# Altium schematic sheet USB-TTL UART.SchDoc
size A4; SheetNumber: 3; SheetTotal: 13
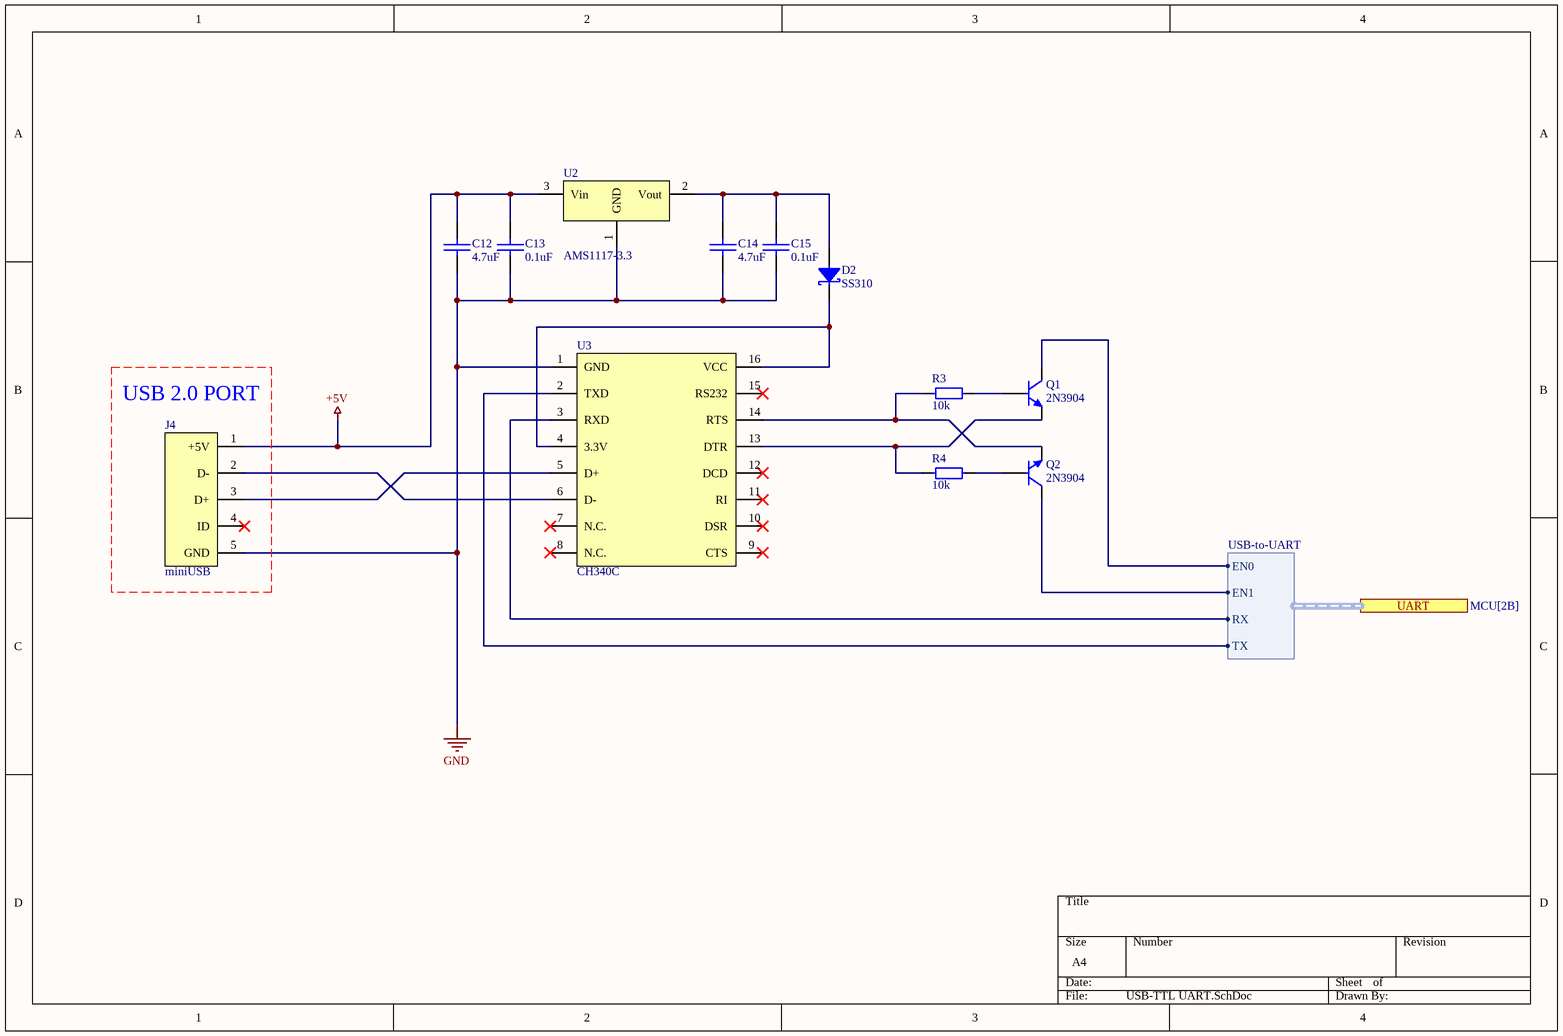
[diagram p0: USB-TTL UART.SchDoc]

## Parts
C12  4.7uF  [0805 Capicator]
C13  0.1uF  [0805 Capicator]
C14  4.7uF  [0805 Capicator]
C15  0.1uF  [0805 Capicator]
D2  SS310  [DIODE: SMB]
J4  miniUSB  [miniUSB 5pin]
Q1  2N3904  [TO-92]
Q2  2N3904  [TO-92]
R3  10k  [0805 Resistor]
R4  10k  [0805 Resistor]
U2  AMS1117-3.3  [SOT-223]
U3  CH340C  [SOP-16]

## Ports
UART (harness USB-to-UART, see MCU[2B])

## Harnesses
USB-to-UART: EN0, EN1, RX, TX

## Nets
+5V: C12.2 C13.2 J4.1(+5V) U2.3(Vin)
GND: C12.1 C13.1 C14.1 C15.1 J4.5(GND) U2.1(GND) U3.1(GND)
NetC14_2: C14.2 C15.2 D2.1 U2.2(Vout)
NetD2_2: D2.2 U3.4(3.3V) U3.16(VCC)
NetJ4_2: J4.2(D-) U3.6(D-)
NetJ4_3: J4.3(D+) U3.5(D+)
NetQ1_1: Q1.1(Collector) ; port UART.EN0
NetQ1_2: Q1.2(Base) R3.2
NetQ1_3: Q1.3(Emitter) R4.1 U3.13(DTR)
NetQ2_1: Q2.1(Collector) ; port UART.EN1
NetQ2_2: Q2.2(Base) R4.2
NetQ2_3: Q2.3(Emitter) R3.1 U3.14(RTS)
NetU3_2: U3.2(TXD) ; port UART.TX
NetU3_3: U3.3(RXD) ; port UART.RX

Not connected (* = marked no-connect by the designer): J4 4(ID)*; U3 7(N.C.)* 8(N.C.)* 9(CTS)* 10(DSR)* 11(RI)* 12(DCD)* 15(RS232)*

## Notes on the sheet
- (near J4) USB 2.0 PORT

## Library data of the parts
C12 C14 = Cap 4.7uF (0805): 4.7uF X5R 10% 25V 0805; Manufacturer: Murata Manufacturing; Part Number: GRM21BR61E475KA12L; Type: Capacitor; ComponentLink1Description: Chip&Dip; ComponentLink1URL: https://www.chipdip.ru/product/grm21br61e475ka12l
C13 C15 = Cap 0.1uF (0805): 0.1uF X7R 25V 10% 0805; Manufacturer: Murata Manufacturing; Part Number: GRM21BR71E104KA01L; Type: Capacitor; ComponentLink1Description: Chip&Dip; ComponentLink1URL: https://www.chipdip.ru/product/grm21br71e104ka01l
D2 = Schottky diode SS310: 100B 3.0A Schottky diode; ComponentLink1Description: Buy; ComponentLink1URL: https://radioremont.com/product/diod-ss310-k181-17/#/overview/; Type: Diode; ComponentLink2Description: Datasheet; ComponentLink2URL: https://radioremont.com/wa-data/public/shop/products/99/92/9299/attachments/SS32%20–%20SS310.pdf
J4 = Connector miniUSB 5pin: miniUSB 5PIN; Type: Connector; ComponentLink1Description: Buy; ComponentLink1URL: https://radioremont.com/product/gnezdo-miniusb-5pin-4-k36-12/
Q1 Q2 = Transitor NPN 2N3904: Transistor NPN 40V 0.2A 0.35W; Type: Transistor; ComponentLink1Description: Buy; ComponentLink1URL: https://radioremont.com/product/tranzistor-2n3904-k21-1/; ComponentLink2Description: Datasheet; ComponentLink2URL: https://docviewer.yandex.ru/view/1461771748/?page=2&*=4jwz2D4dd0sparxb2jwU5gxgGwZ7InVybCI6Imh0dHBzOi8vcGwtMS5vcmcvZ2V0cHJvZHVjdGZpbGUuYXhkP2lkPTMyMjAmZmlsZW5hbWU9Mk4zOTA0LnBkZiIsInRpdGxlIjoiZ2V0cHJvZHVjdGZpbGUuYXhkP2lkPTMyMjAiLCJub2lmcmFtZSI6dHJ1ZSwidWlkIjoiMTQ2MTc3MTc0OCIsInRzIjoxNzA2NDc0MzY0NTg0LCJ5dSI6IjIzNTYwOTg1MzE2OTMyNDI4MTQiLCJzZXJwUGFyYW1zIjoidG09MTcwNjQ3NDM2MSZ0bGQ9cnUmbGFuZz1lbiZuYW1lPWdldHByb2R1Y3RmaWxlLmF4ZD9pZD0zMjIwJmZpbGVuYW1lPTJOMzkwNC5wZGYmdGV4dD0ybjM5MDQrZGF0YXNoZWV0JnVybD1odHRwcyUzQS8vcGwtMS5vcmcvZ2V0cHJvZHVjdGZpbGUuYXhkJTNGaWQlM0QzMjIwJTI2ZmlsZW5hbWUlM0QyTjM5MDQucGRmJmxyPTIxMyZtaW1lPXBkZiZsMTBuPXJ1JnNpZ249NDkwNjZmM2VkZjY0ZGJiMGQwNWIxY2M2YjZkZDc4ZTgma2V5bm89MCJ9&lang=en
R3 R4 = Res 10k (0805): 0.125W 0805 10k, 1%; Part Number: RC0805FR-0710KL; Manufacturer: Taiwan; Type: Resistor; ComponentLink1Description: Chip&Dip; ComponentLink1URL: https://www.chipdip.ru/product0/9000079514
U2 = LDO AMS1117: 1A 3.3V Low dropout voltage regulator; Type: IC; ComponentLink1Description: Buy; ComponentLink1URL: https://radioremont.com/product/mikroskhema-ams1117-3-3v-sot-223-k30-4/; ComponentLink2Description: Datasheet; ComponentLink2URL: https://radioremont.com/wa-data/public/shop/products/89/27/2789/attachments/AMS1117.pdf
U3 = USB-TTL UART CH340C: CH340 is a USB bus conversion chip, it can realize USB to UART interface or USB to printer interface; Type: IC; ComponentLink1Description: Buy; ComponentLink1URL: https://radioremont.com/product/mikroskhema-ch340c-k158-2/; ComponentLink2Description: Datasheet; ComponentLink2URL: https://radioremont.com/wa-data/public/shop/products/76/21/12176/attachments/CH340.pdf